# Altium schematic sheet 03.MCU.SchDoc
size A4; DocumentNumber: 04; SheetNumber: 4; SheetTotal: 8; Page: MCU
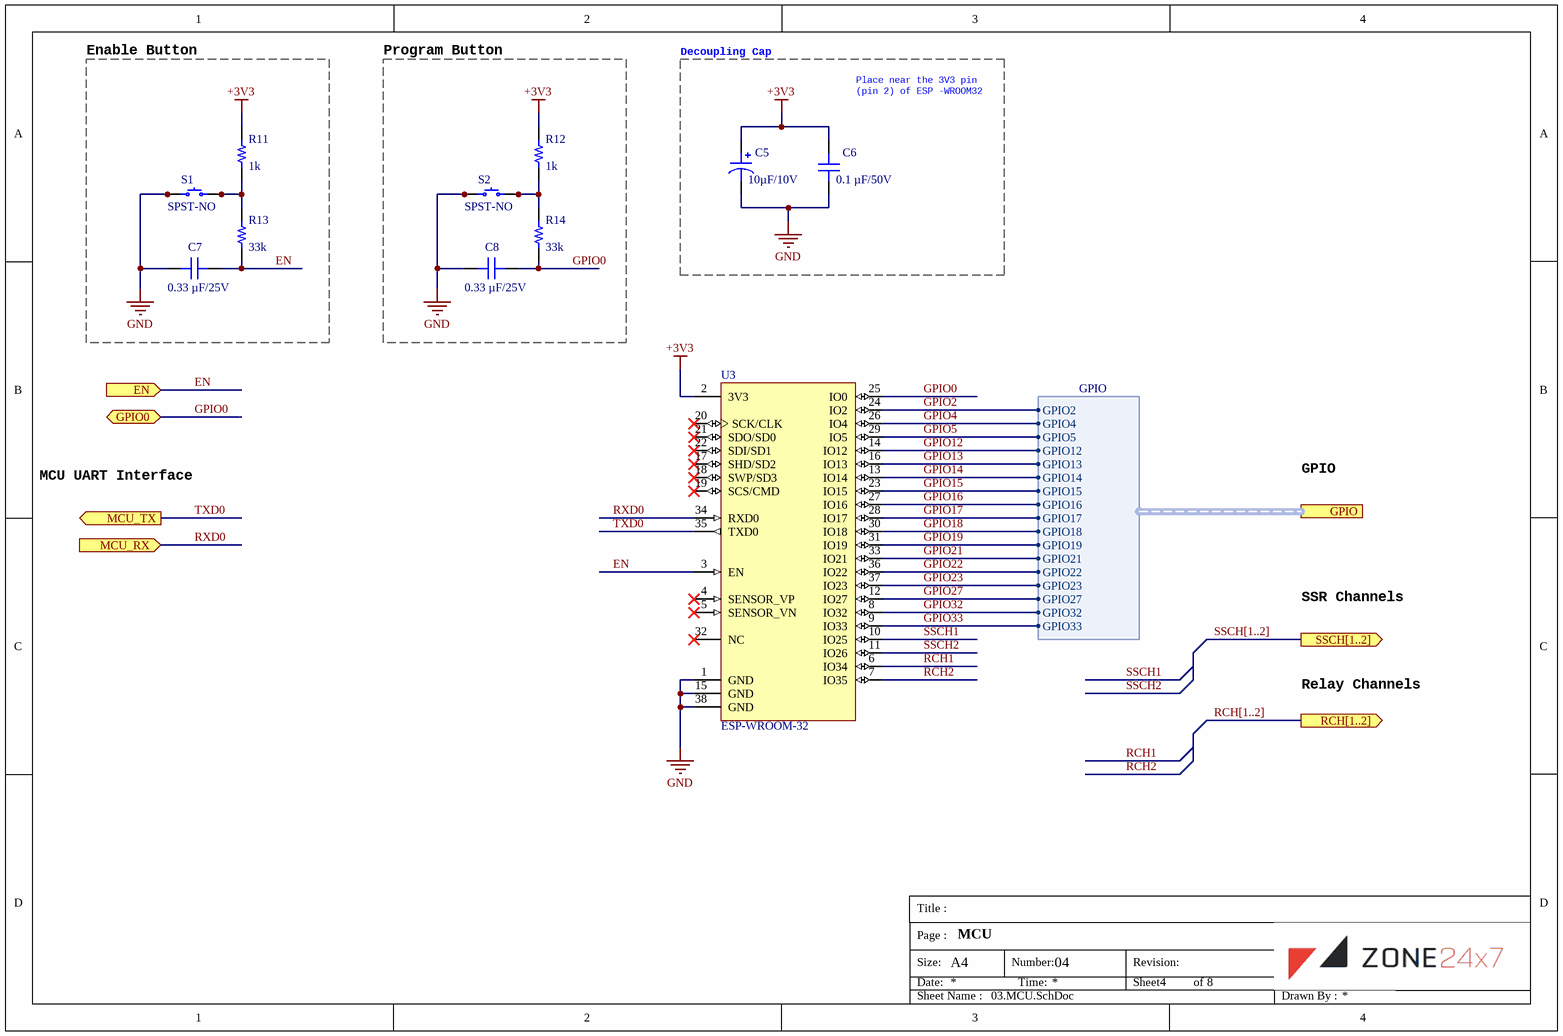
[diagram p0: 03.MCU.SchDoc]

## Parts
C5  10µF/10V  [CAP POL 1411_3528]
C6  0.1 µF/50V  [CAP 0805_2012]
C7  0.33 µF/25V  [CAP 0603_1608]
C8  0.33 µF/25V  [CAP 0603_1608]
R11  1k  [RES 0603_1608]
R12  1k  [RES 0603_1608]
R13  33k  [RES 0603_1608]
R14  33k  [RES 0603_1608]
S1  SPST-NO  [TE FSM4JSMA]
S2  SPST-NO  [TE FSM4JSMA]
U3  ESP-WROOM-32  [OLMX-ESP-WROOM-32]

## Blocks framed on the sheet
Enable Button: C7 R11 R13 S1
Program Button: C8 R12 R14 S2
Decoupling Cap: C5 C6

## Ports
EN (in), GPIO0 (bidir), GPIO (harness GPIO), MCU_RX (in), MCU_TX (out), RCH[1..2] (out), SSCH[1..2] (out)

## Harnesses
GPIO: GPIO2, GPIO4, GPIO5, GPIO12, GPIO13, GPIO14, GPIO15, GPIO16, GPIO17, GPIO18, GPIO19, GPIO21, GPIO22, GPIO23, GPIO27, GPIO32, GPIO33

## Nets
+3V3: C5.1 C6.2 R11.2 R12.2 U3.2(3V3)
GND: C5.2 C6.1 C7.2 C8.2 S1.1 S1.2 S2.1 S2.2 U3.1(GND) U3.15(GND) U3.38(GND)
EN: C7.1 R13.1 U3.3(EN) ; port EN
GPIO0: C8.1 R14.1 U3.25(IO0) ; port GPIO0
GPIO2: U3.24(IO2) ; port GPIO.GPIO2
GPIO4: U3.26(IO4) ; port GPIO.GPIO4
GPIO5: U3.29(IO5) ; port GPIO.GPIO5
GPIO12: U3.14(IO12) ; port GPIO.GPIO12
GPIO13: U3.16(IO13) ; port GPIO.GPIO13
GPIO14: U3.13(IO14) ; port GPIO.GPIO14
GPIO15: U3.23(IO15) ; port GPIO.GPIO15
GPIO16: U3.27(IO16) ; port GPIO.GPIO16
GPIO17: U3.28(IO17) ; port GPIO.GPIO17
GPIO18: U3.30(IO18) ; port GPIO.GPIO18
GPIO19: U3.31(IO19) ; port GPIO.GPIO19
GPIO21: U3.33(IO21) ; port GPIO.GPIO21
GPIO22: U3.36(IO22) ; port GPIO.GPIO22
GPIO23: U3.37(IO23) ; port GPIO.GPIO23
GPIO27: U3.12(IO27) ; port GPIO.GPIO27
GPIO32: U3.8(IO32) ; port GPIO.GPIO32
GPIO33: U3.9(IO33) ; port GPIO.GPIO33
RCH1: U3.6(IO34)
RCH2: U3.7(IO35)
RXD0: U3.34(RXD0) ; port MCU_RX
SSCH1: U3.10(IO25)
SSCH2: U3.11(IO26)
TXD0: U3.35(TXD0) ; port MCU_TX
NetR11_1: R11.1 R13.2 S1.3 S1.4
NetR12_1: R12.1 R14.2 S2.3 S2.4

Not connected (* = marked no-connect by the designer): U3 4(SENSOR_VP)* 5(SENSOR_VN)* 17(SHD/SD2)* 18(SWP/SD3)* 19(SCS/CMD)* 20(SCK/CLK)* 21(SDO/SD0)* 22(SDI/SD1)* 32(NC)*

## Buses and harness runs
bus RCH[1..2] = port RCH[1..2]
bus SSCH[1..2] = port SSCH[1..2]

## Notes on the sheet
- (near C6) Place near the 3V3 pin (pin 2) of ESP -WROOM32
- MCU UART Interface
- GPIO
- SSR Channels
- Relay Channels
- Title :
- Size:
- Date:
- Page :
- A4
- Number:
- Time:
- Revision:
- Sheet
- of
- Sheet Name :
- Drawn By :

## Library data of the parts
C5 = TAJB106K010TNJ: 10uF 10V 2.1Ω@100kHz ±10% 1411 Tantalum Capacitors ROHS; manufacturer: AVX Corporation; Manufacturer Part Number: TAJB106K010TNJ; Value: 10µF/10V; JLC Part Number: C1953247
C6 = CC0805MRX7R9BB104: 50V 100nF 2X1 ±10% 0805 Multilayer Ceramic Capacitors MLCC - SMD/SMT ROHS; Manufacturer Part Number: CT41G-0805-2X1-50V-0.1μF-K(N); manufacturer: TORCH; Value: 0.1 µF/50V; JLC Part Number: C126469
C7 C8 = CC0603KRX7R7BB334: 25V 330nF X7R ±10% 0603 Multilayer Ceramic Capacitors MLCC - SMD/SMT ROHS; Manufacturer Part Number: CC0603KRX7R8BB334; manufacturer: Yageo; Value: 0.33 µF/25V; JLC Part Number: C107070
R11 R12 = CRCW0603150RFKEA: 100mW ±100ppm/℃ ±1% 1kΩ 0603 Chip Resistor - Surface Mount ROHS; Manufacturer Part Number: RTT031001FTP; Manufacturer: RALEC; Value: 1k; JLC Part Number: C103198
R13 R14 = CRCW0603150RFKEA: 100mW ±100ppm/℃ ±1% 33kΩ 0603 Chip Resistor - Surface Mount ROHS; Manufacturer Part Number: RTT033302FTP; Manufacturer: RALEC; Value: 33k; JLC Part Number: C103544
S1 S2 = FSM4JSMATR: SWITCH TACTILE SPST-NO 0.05A 24V; Manufacturer: TE Connectivity ALCOSWITCH Switches; Manufacturer Part Number: FSM4JSMATR; JLC Part Number: *
U3 = OLMX-ESP-WROOM-32-38: SMD,18x25.5mm WiFi Modules ROHS; Manufacturer: Espressif Systems; Manufacturer Part Number: ESP32-WROOM-32-N4; JLC Part Number: C82899